# EAGLE design coin20mm_updated (EAGLE 9.3.0)
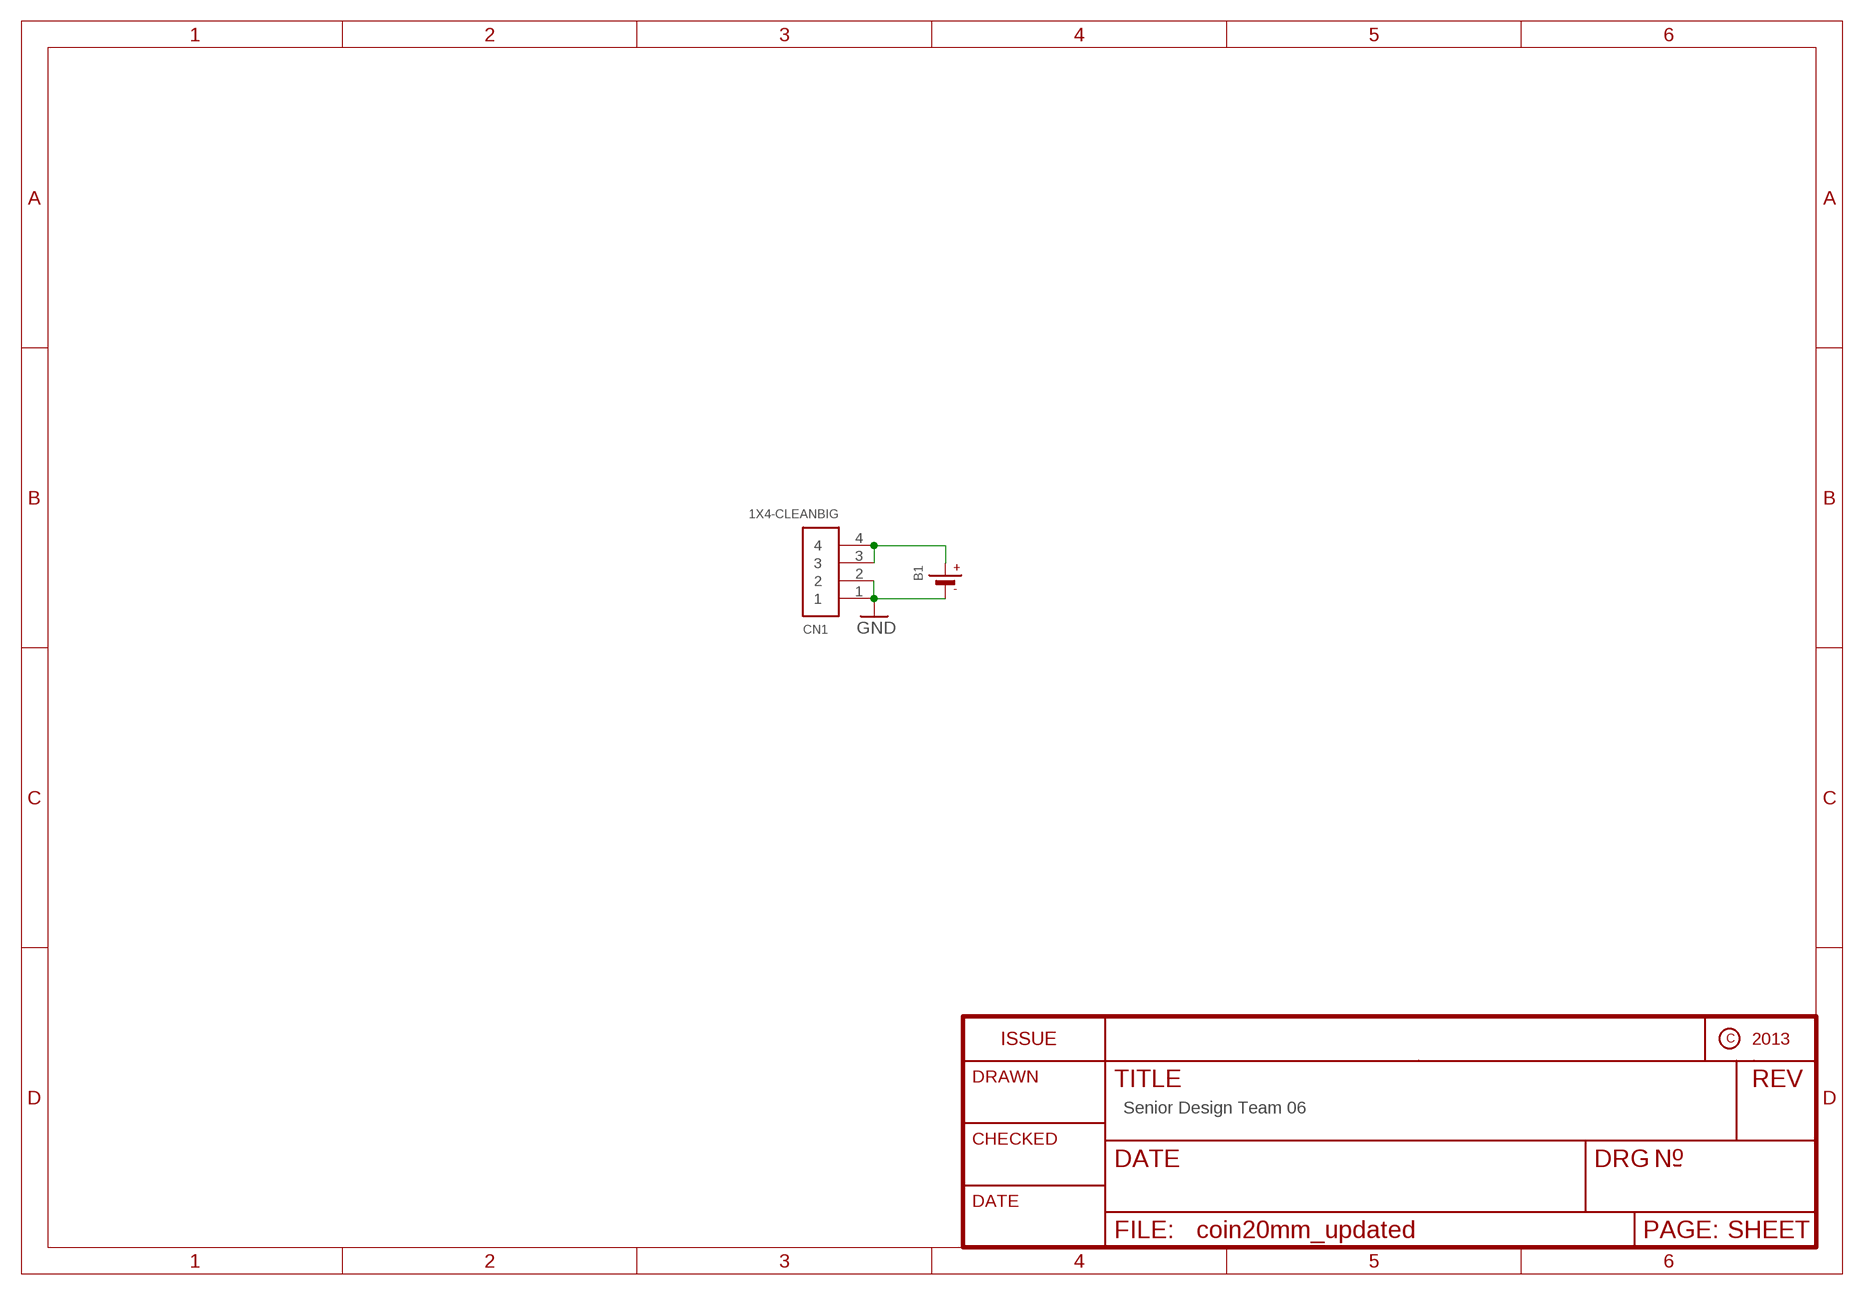
[diagram p0: schematic, sheet 1]
FRAME1 (FRAME_A4): TITLE: Senior Design Team 06

## Parts
B1  BATTERYCR2032_BAT-HLD-001  [CR2032_SMT_BAT-HLD-001]
CN1  1X4-CLEANBIG  [1X04-CLEANBIG]

## Nets
GND: B1.- CN1.1 CN1.2
VCC: B1.+$1(+) B1.+$2(+) CN1.3 CN1.4

## Library data of the parts
B1 = microbuilder:BATTERY: CR1220 SMT - Digikey: 3001K-ND CD2032 BAT-HLD-001 - Digikey: BAT-HLD-001-ND
CN1 = adafruit2:1X4: 4-pin connector

## Board
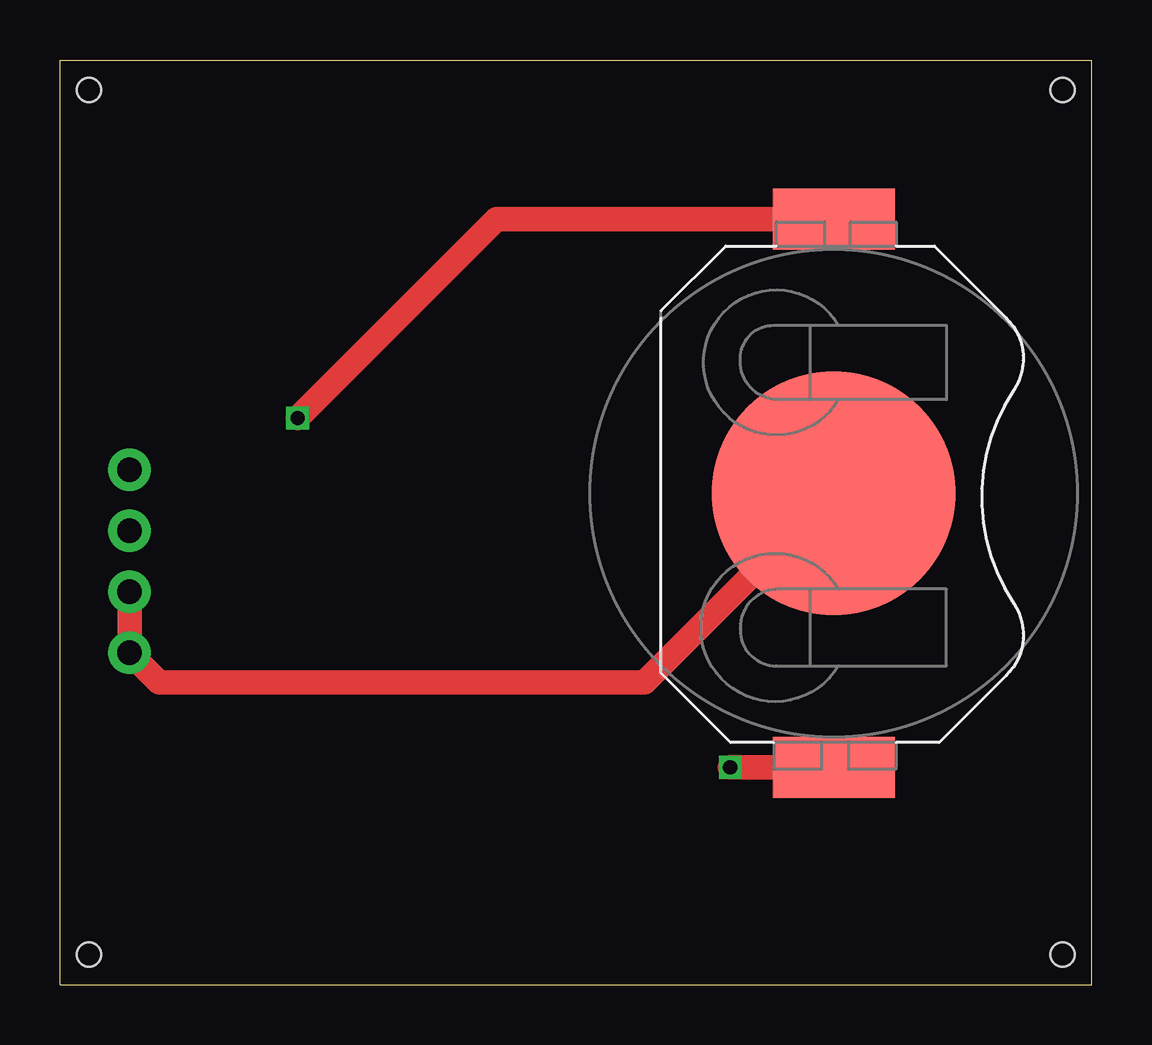
[diagram p1: board, top side]
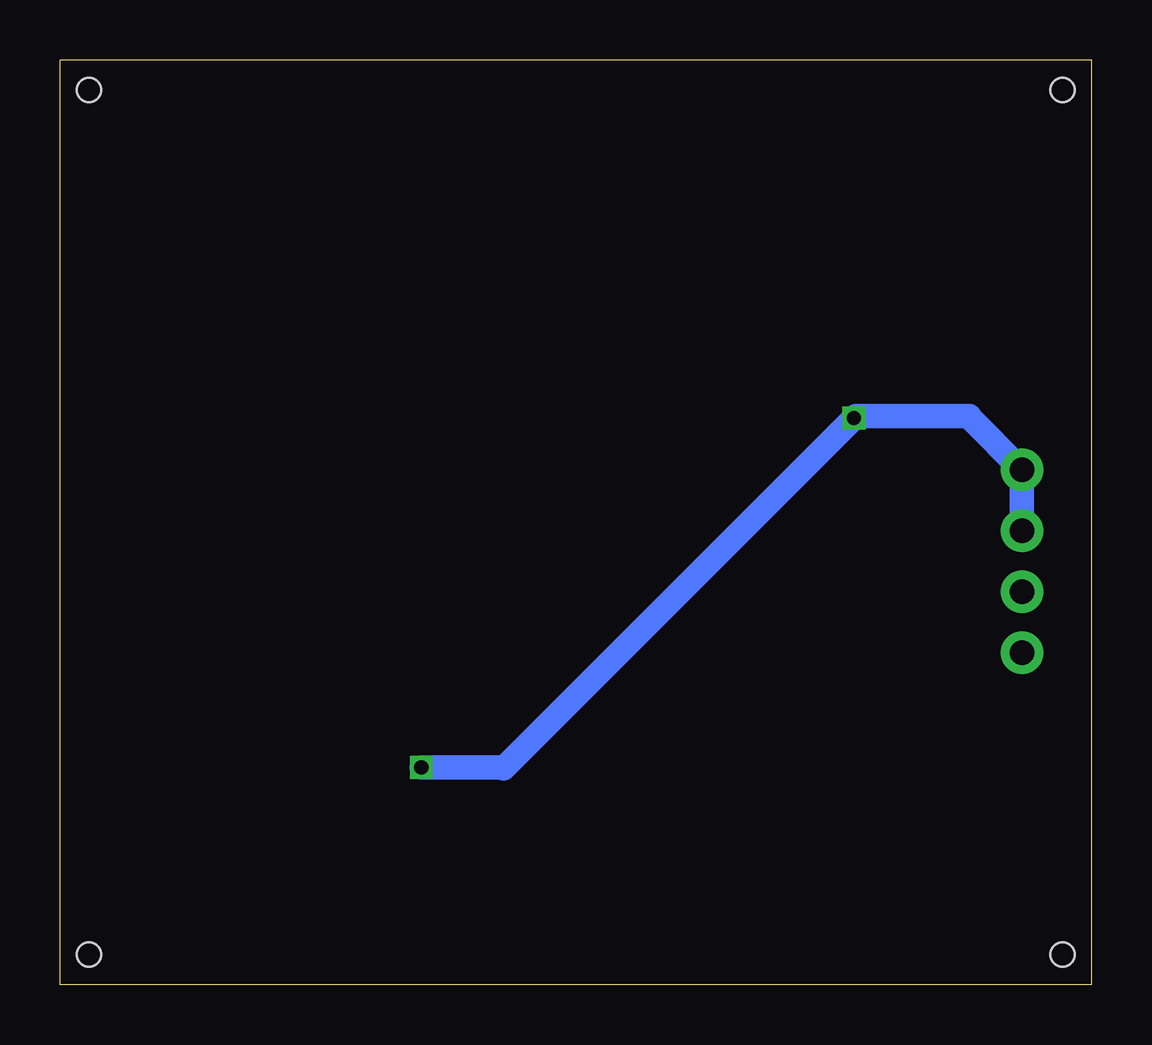
[diagram p2: board, bottom side, seen from below]

Size 43 x 38.55 mm. Coordinates in mm from the lower left corner, seen from the top.
Outline: 0,0 0,38.55 43,38.55 43,0 0,0
Copper layers (1*16): Top 0.0356mm / dielectric 1.5011mm / Bottom 0.0356mm
Design rules "ECE_Senior_Design": minimum track width 8mil, minimum drill 13mil, track to track 8mil, track to pad 8mil, pad to pad 6mil, via to via 8mil, smd to smd 6mil, copper to edge 15mil, drill to drill 8mil, minimum pad ring 7mil, minimum via ring 7mil, stop-mask expansion 3mil, vias tented up to drill 0mil, thermal gap 10mil
Holes 1 mm at 41.8,37.3 1.2,37.3 1.2,1.25 41.8,1.25

### Footprints (pad centres in the part's own frame; a part is rotated, then mirrored left to right if it is on the bottom)
CR2032_SMT_BAT-HLD-001 = smd 2.54 x 5.08: +$1 -11.43,0; +$2 11.43,0 | smd 10.16 x 10.16: - 0,0
1X04-CLEANBIG = drill 1.016 pad 1.778: 1 -3.81,0; 2 -1.27,0; 3 1.27,0; 4 3.81,0

### Placement (x,y rotation side)
B1  32.26,20.49 90 top
CN1  2.9,17.65 90 top

### Tracks (layer width: path | path; a pad name or v marks a point on that pad's centre or on a via)
GND
  Top 1.016: CN1.2 CN1.1 4.14,12.6 24.36,12.6 B1.-
VCC  (via drill 0.6)
  Top 1.016: v27.94,9.06 B1.+$1 | B1.+$2 18.21,31.92 v9.91,23.62
  Bottom 0.203: 5.1,23.66 5.1,23.7 | 9.83,23.7 v9.91,23.62
  Bottom 1.016: CN1.3 CN1.4 5.1,23.66 | v27.94,9.06 24.51,9.06 24.51,9.02 v9.91,23.62 | 5.1,23.7 9.83,23.7